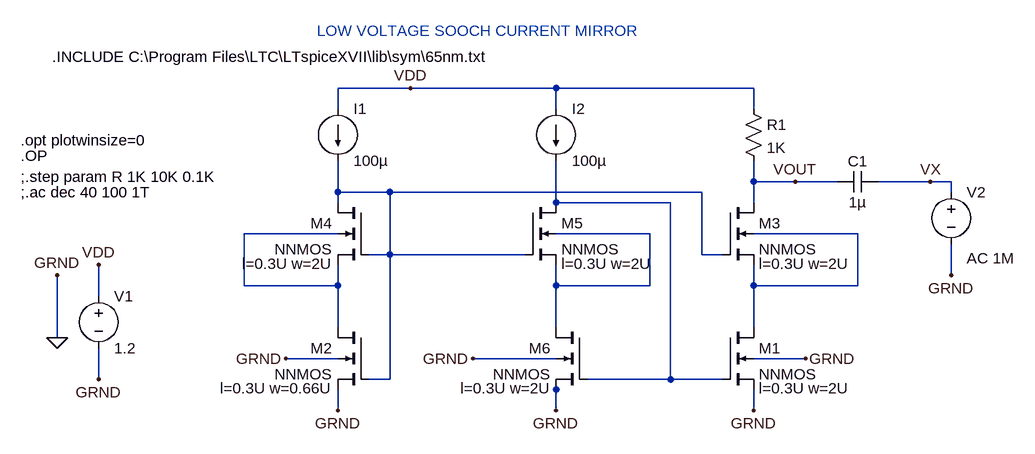
[diagram p0: schematic 15LOW VOLTAGE SOOCH CURRENT SINK.asc]
15LOW VOLTAGE SOOCH CURRENT SINK.asc, the LTspice schematic file:
Version 4
SHEET 1 1028 680
WIRE 112 -144 0 -144
WIRE 336 -144 112 -144
WIRE 640 -144 336 -144
WIRE 0 -112 0 -144
WIRE 336 -112 336 -144
WIRE 640 -112 640 -144
WIRE 640 0 640 -32
WIRE 704 0 640 0
WIRE 768 0 704 0
WIRE 912 0 832 0
WIRE 944 0 912 0
WIRE 0 16 0 -32
WIRE 80 16 0 16
WIRE 560 16 80 16
WIRE 944 16 944 0
WIRE 0 32 0 16
WIRE 336 32 336 -32
WIRE 512 32 336 32
WIRE 640 32 640 0
WIRE 0 80 -144 80
WIRE 480 80 336 80
WIRE 800 80 640 80
WIRE 80 112 80 16
WIRE 80 112 48 112
WIRE 288 112 80 112
WIRE 560 112 560 16
WIRE 592 112 560 112
WIRE 944 144 944 96
WIRE -144 160 -144 80
WIRE 0 160 0 128
WIRE 0 160 -144 160
WIRE 336 160 336 128
WIRE 480 160 480 80
WIRE 480 160 336 160
WIRE 640 160 640 128
WIRE 800 160 800 80
WIRE 800 160 640 160
WIRE -368 176 -368 128
WIRE 0 224 0 160
WIRE 336 224 336 160
WIRE 640 224 640 160
WIRE -432 240 -432 144
WIRE 0 272 -80 272
WIRE 336 272 208 272
WIRE 720 272 640 272
WIRE -368 304 -368 256
WIRE 80 304 80 112
WIRE 80 304 48 304
WIRE 512 304 512 32
WIRE 512 304 384 304
WIRE 592 304 512 304
WIRE 336 320 336 304
WIRE 0 352 0 320
WIRE 336 352 336 320
WIRE 640 352 640 320
FLAG -432 240 0
FLAG -368 128 VDD
FLAG -432 144 GRND
FLAG -368 304 GRND
FLAG 0 352 GRND
FLAG 640 352 GRND
FLAG -80 272 GRND
FLAG 720 272 GRND
FLAG 944 144 GRND
FLAG 112 -144 VDD
FLAG 912 0 VX
FLAG 704 0 VOUT
FLAG 336 352 GRND
FLAG 208 272 GRND
SYMBOL nmos4 592 224 R0
WINDOW 123 56 94 Left 2
SYMATTR Value2 l=0.3U w=2U
SYMATTR InstName M1
SYMATTR Value NNMOS
SYMBOL nmos4 48 224 M0
WINDOW 123 56 94 Left 2
SYMATTR Value2 l=0.3U w=0.66U
SYMATTR InstName M2
SYMATTR Value NNMOS
SYMBOL voltage -368 160 R0
WINDOW 123 0 0 Left 0
WINDOW 39 0 0 Left 0
SYMATTR InstName V1
SYMATTR Value 1.2
SYMBOL current 0 -112 R0
SYMATTR InstName I1
SYMATTR Value 100µ
SYMBOL res 624 -128 R0
SYMATTR InstName R1
SYMATTR Value 1K
SYMBOL cap 832 -16 R90
WINDOW 0 0 32 VBottom 2
WINDOW 3 32 32 VTop 2
SYMATTR InstName C1
SYMATTR Value 1µ
SYMBOL voltage 944 0 R0
WINDOW 123 24 118 Left 2
WINDOW 39 0 0 Left 0
SYMATTR Value2 AC 1M
SYMATTR InstName V2
SYMATTR Value ""
SYMBOL nmos4 592 32 R0
WINDOW 123 56 94 Left 2
SYMATTR Value2 l=0.3U w=2U
SYMATTR InstName M3
SYMATTR Value NNMOS
SYMBOL nmos4 48 32 M0
WINDOW 123 56 94 Left 2
SYMATTR Value2 l=0.3U w=2U
SYMATTR InstName M4
SYMATTR Value NNMOS
SYMBOL current 336 -112 R0
SYMATTR InstName I2
SYMATTR Value 100µ
SYMBOL nmos4 288 32 R0
WINDOW 123 56 94 Left 2
SYMATTR Value2 l=0.3U w=2U
SYMATTR InstName M5
SYMATTR Value NNMOS
SYMBOL nmos4 384 224 M0
WINDOW 123 56 94 Left 2
SYMATTR Value2 l=0.3U w=2U
SYMATTR InstName M6
SYMATTR Value NNMOS
TEXT -440 -192 Left 2 !.INCLUDE C:\\Program Files\\LTC\\LTspiceXVII\\lib\\sym\\65nm.txt
TEXT -488 -64 Left 2 !.opt plotwinsize=0
TEXT -488 -40 Left 2 !.OP
TEXT -488 -8 Left 2 !;.step param R 1K 10K 0.1K
TEXT -488 16 Left 2 !;.ac dec 40 100 1T
TEXT -32 -232 Left 2 ;LOW VOLTAGE SOOCH CURRENT MIRROR

The netlist it stands for:
* 15LOW VOLTAGE SOOCH CURRENT SINK.asc
M1 N005 N002 0 0 NNMOS l=0.3U w=2U
M2 N003 N001 0 0 NNMOS l=0.3U w=0.66U
V1 VDD 0 1.2
I1 VDD N001 100µ
R1 VDD VOUT 1K
C1 VX VOUT 1µ
V2 VX 0 AC 1M
M3 VOUT N001 N005 N005 NNMOS l=0.3U w=2U
M4 N001 N001 N003 N003 NNMOS l=0.3U w=2U
I2 VDD N002 100µ
M5 N002 N001 N004 N004 NNMOS l=0.3U w=2U
M6 N004 N002 0 0 NNMOS l=0.3U w=2U
.model NMOS NMOS
.model PMOS PMOS
.lib standard.mos
.INCLUDE C:\Program Files\LTC\LTspiceXVII\lib\sym\65nm.txt
.opt plotwinsize=0
.OP
;.step param R 1K 10K 0.1K
;.ac dec 40 100 1T
* LOW VOLTAGE SOOCH CURRENT MIRROR
.backanno
.end